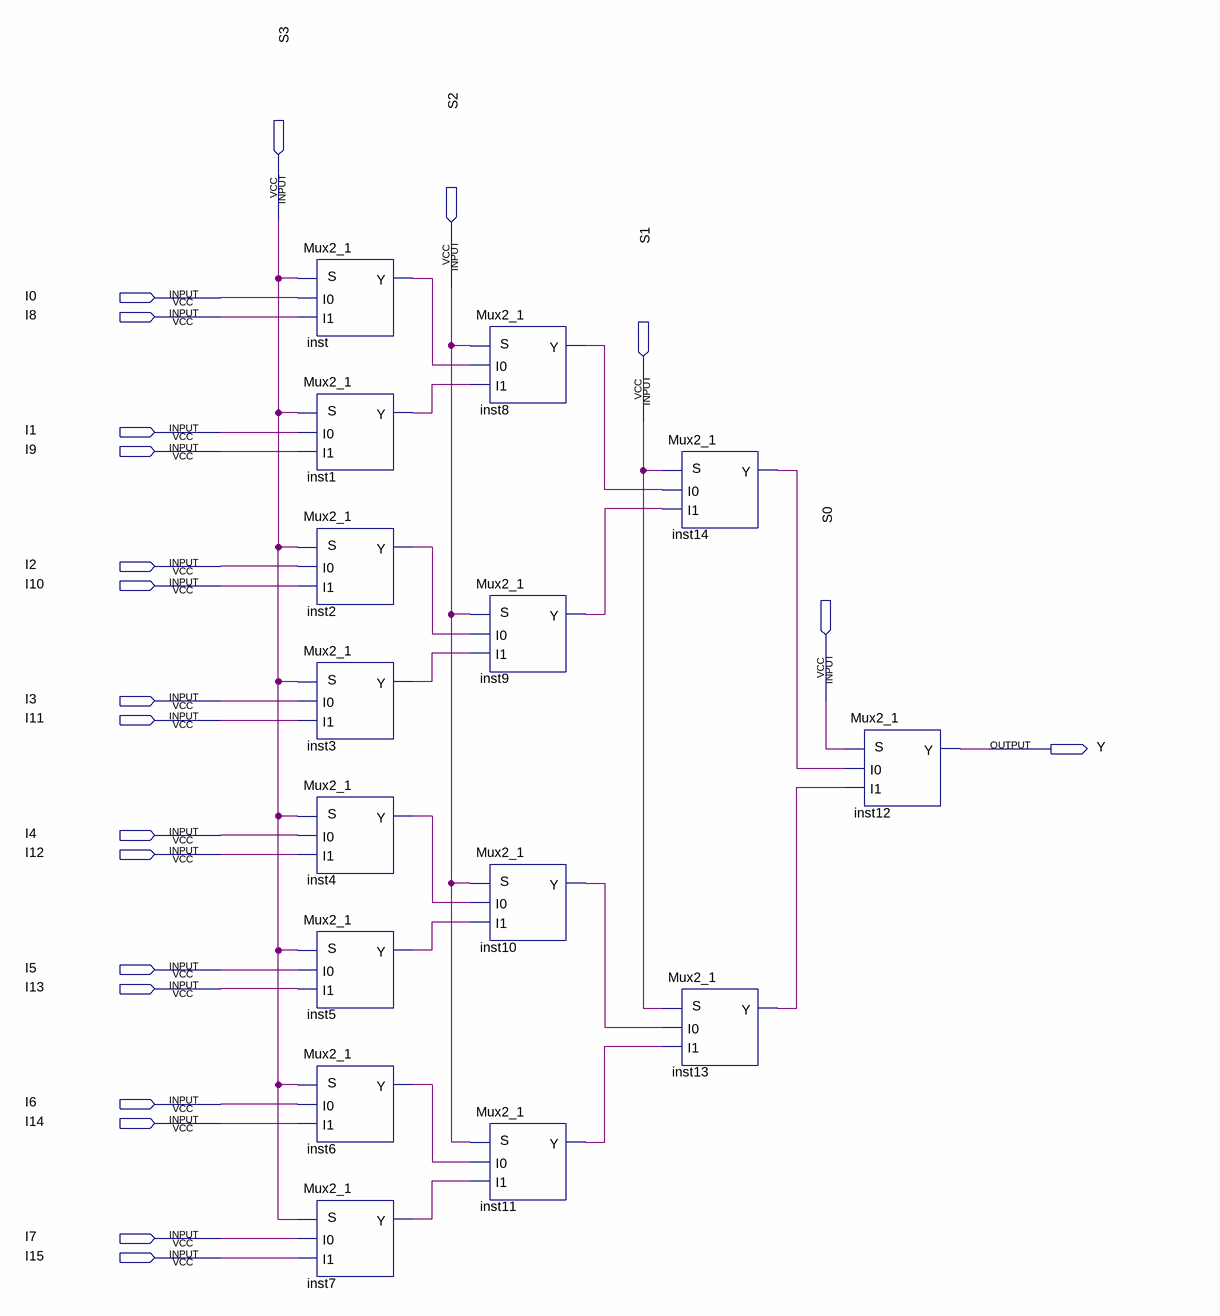
[diagram p0: schematic sheet]
// Quartus schematic Mux16_1.bdf as structural Verilog: 15 symbols, 21 pins
module Mux16_1 (
  input  S3,
  input  S2,
  input  I0,
  input  I8,
  input  S1,
  input  I1,
  input  I9,
  input  I2,
  input  I10,
  input  I3,
  input  S0,
  input  I11,
  input  I4,
  input  I12,
  input  I5,
  input  I13,
  input  I6,
  input  I14,
  input  I7,
  input  I15,
  output Y
);

  wire inst1_y, inst2_y, inst3_y, inst4_y, inst5_y, inst6_y, inst7_y, inst8_y, inst9_y, inst10_y, inst11_y,
       inst13_y, inst14_y, inst_y;

  Mux2_1 inst (.I0(I0), .S(S3), .I1(I8), .Y(inst_y));
  Mux2_1 inst1 (.I0(I1), .S(S3), .I1(I9), .Y(inst1_y));
  Mux2_1 inst2 (.I0(I2), .S(S3), .I1(I10), .Y(inst2_y));
  Mux2_1 inst3 (.I0(I3), .S(S3), .I1(I11), .Y(inst3_y));
  Mux2_1 inst4 (.I0(I4), .S(S3), .I1(I12), .Y(inst4_y));
  Mux2_1 inst5 (.I0(I5), .S(S3), .I1(I13), .Y(inst5_y));
  Mux2_1 inst6 (.I0(I6), .S(S3), .I1(I14), .Y(inst6_y));
  Mux2_1 inst7 (.I0(I7), .S(S3), .I1(I15), .Y(inst7_y));
  Mux2_1 inst8 (.I0(inst_y), .S(S2), .I1(inst1_y), .Y(inst8_y));
  Mux2_1 inst9 (.I0(inst2_y), .S(S2), .I1(inst3_y), .Y(inst9_y));
  Mux2_1 inst10 (.I0(inst4_y), .S(S2), .I1(inst5_y), .Y(inst10_y));
  Mux2_1 inst11 (.I0(inst6_y), .S(S2), .I1(inst7_y), .Y(inst11_y));
  Mux2_1 inst14 (.I0(inst8_y), .S(S1), .I1(inst9_y), .Y(inst14_y));
  Mux2_1 inst13 (.I0(inst10_y), .S(S1), .I1(inst11_y), .Y(inst13_y));
  Mux2_1 inst12 (.I0(inst14_y), .S(S0), .I1(inst13_y), .Y(Y));
endmodule
